# EAGLE design version_1_OK_fixed (EAGLE 6.5.0)
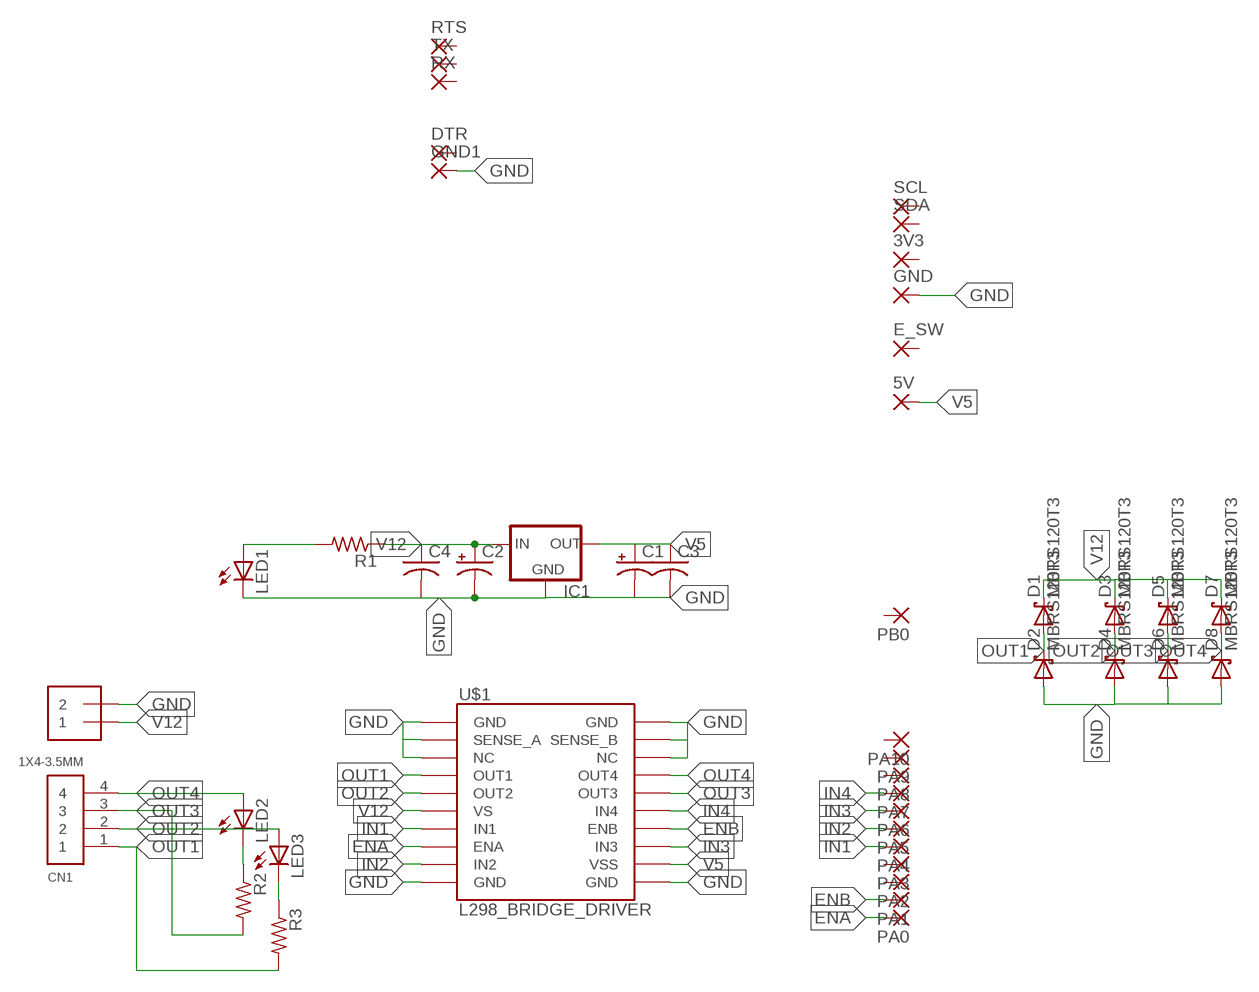
[diagram p0: schematic, sheet 1]

## Parts
3V3  1,6/0,9  [1,6/0,9]
5V  1,6/0,9  [1,6/0,9]
C1  CPOL-USA/3216-18R  [A/3216-18R]
C2  CPOL-USCT7343  [CT7343]
C3  C-USC0805  [C0805]
C4  C-USC0805  [C0805]
CN1  1X4-3.5MM  [1X04-3.5MM]
D1  MBRS120T3  [DO214AA]
D2  MBRS120T3  [DO214AA]
D3  MBRS120T3  [DO214AA]
D4  MBRS120T3  [DO214AA]
D5  MBRS120T3  [DO214AA]
D6  MBRS120T3  [DO214AA]
D7  MBRS120T3  [DO214AA]
D8  MBRS120T3  [DO214AA]
DTR  1,6/0,9  [1,6/0,9]
E_SW  1,6/0,9  [1,6/0,9]
GND  1,6/0,8  [1,6/0,8]
GND1  1,6/0,9  [1,6/0,9]
IC1  LM1117  [SOT223]
J1  1X2-3.5MM  [1X2-3.5MM]
LED1  LEDSMT1206  [1206]
LED2  LEDSMT1206  [1206]
LED3  LEDSMT1206  [1206]
PA0  1,6/0,9  [1,6/0,9]
PA1  1,6/0,9  [1,6/0,9]
PA2  1,6/0,9  [1,6/0,9]
PA3  1,6/0,9  [1,6/0,9]
PA4  1,6/0,9  [1,6/0,9]
PA5  1,6/0,9  [1,6/0,9]
PA6  1,6/0,9  [1,6/0,9]
PA7  1,6/0,9  [1,6/0,9]
PA8  1,6/0,9  [1,6/0,9]
PA9  1,6/0,9  [1,6/0,9]
PA10  1,6/0,9  [1,6/0,9]
PB0  1,6/0,9  [1,6/0,9]
R1  R-US_R0805  [R0805]
R2  R-US_R0805  [R0805]
R3  R-US_R0805  [R0805]
RTS  1,6/0,9  [1,6/0,9]
RX  1,6/0,9  [1,6/0,9]
SCL  1,6/0,9  [1,6/0,9]
SDA  1,6/0,9  [1,6/0,9]
TX  1,6/0,9  [1,6/0,9]
U$1  L298_BRIDGE_DRIVER  [POWERSO20]

## Nets
ENA: PA0.1(P) U$1.P$8(ENA)
ENB: PA1.1(P) U$1.P$14(ENB)
GND: C1.- C2.- C3.2 C4.2 D2.A D4.A D6.A D8.A GND1.1(P) GND.1(P) IC1.1(GND) J1.2 LED1.C U$1.P$1(GND) U$1.P$2(SENSE_A) U$1.P$3(NC) U$1.P$10(GND) U$1.P$11(GND) U$1.P$18(NC) U$1.P$19(SENSE_B) U$1.P$20(GND)
IN1: PA4.1(P) U$1.P$7(IN1)
IN2: PA5.1(P) U$1.P$9(IN2)
IN3: PA6.1(P) U$1.P$13(IN3)
IN4: PA7.1(P) U$1.P$15(IN4)
N$1: LED1.A R1.2
N$2: LED2.C R2.1
N$3: LED3.C R3.1
OUT1: CN1.1 D1.A D2.C R3.2 U$1.P$4(OUT1)
OUT2: CN1.2 D3.A D4.C LED3.A U$1.P$5(OUT2)
OUT3: CN1.3 D5.A D6.C R2.2 U$1.P$16(OUT3)
OUT4: CN1.4 D7.A D8.C LED2.A U$1.P$17(OUT4)
V5: 5V.1(P) C1.+ C3.1 IC1.2(OUT) U$1.P$12(VSS)
V12: C2.+ C4.1 D1.C D3.C D5.C D7.C IC1.3(IN) J1.1 R1.1 U$1.P$6(VS)
Unconnected: 3V3.1(P) DTR.1(P) E_SW.1(P) PA2.1(P) PA3.1(P) PA8.1(P) PA9.1(P) PA10.1(P) PB0.1(P) RTS.1(P) RX.1(P) SCL.1(P) SDA.1(P) TX.1(P)

## Library data of the parts
3V3 5V DTR E_SW GND1 PA0 PA1-PA10 PB0 RTS RX SCL SDA TX = wirepad:1,6/0,9: THROUGH-HOLE PAD
C1 C2 = adafruit:CPOL-US: POLARIZED CAPACITOR, American symbol
C3 C4 = adafruit:C-US: CAPACITOR, American symbol
CN1 = adafruit:1X4: 4-pin connector
D1-D8 = mbrs120t3:MBRS120T3: MBRS120T3 Surface Mount Schottky Power Rectifier Reichelt: MBRS 120 SMD
GND = wirepad:1,6/0,8: THROUGH-HOLE PAD
IC1 = v-reg-2:LM1117
J1 = adafruit:1X2: 3.5mm Terminal block http://www.ladyada.net/library/pcb/eaglelibrary.html
LED1-LED3 = adafruit:LED: LED OSRAM: - CHIPLED LG R971, LG N971, LY N971, LG Q971, LY Q971, LO R971, LY R971 LH N974, LH R974 LS Q976, LO Q976, LY Q976 LO Q996 - Hyper CHIPLED LW Q18S LB Q993, LB Q99A, LB R99A - SideLED LS A670, LO A670, LY A670, LG A670, LP A670 LB A673, LV A673, LT A673, LW A673 LH A674 LY A675 LS A676, LA A676, LO A676, LY A676, LW A676 LS A679, LY A679, LG A679 - Hyper Micro SIDELED® LS Y876, LA Y876, LO Y876, LY Y876 LT Y87S - SmartLED LW L88C, LW L88S LB L89C, LB L89S, LG L890 LS L89K, LO L89K, LY L89K LS L896, LA L896, LO L896, LY L896 - TOPLED LS T670, LO T670, LY T670, LG T670, LP T670 LSG T670, LSP T670, LSY T670, LOP T670, LYG T670 LG T671, LOG T671, LSG T671 LB T673, LV T673, LT T673, LW T673 LH T674 LS T676, LA T676, LO T676, LY T676, LB T676, LH T676, LSB T676, LW T676 LB T67C, LV T67C, LT T67C, LS T67K, LO T67K, LY T67K, LW E67C LS E67B, LA E67B, LO E67B, LY E67B, LB E67C, LV E67C, LT E67C LW T67C LS T679, LY T679, LG T679 LS T770, LO T770, LY T770, LG T770, LP T770 LB T773, LV T773, LT T773, LW T773 LH T774 LS E675, LA E675, LY E675, LS T675 LS T776, LA T776, LO T776, LY T776, LB T776 LHGB T686 LT T68C, LB T68C - Hyper Mini TOPLED® LB M676 - Mini TOPLED Santana® LG M470 LS M47K, LO M47K, LY M47K Source: http://www.osram.convergy.de/
R1-R3 = adafruit:R-US_: RESISTOR, American symbol
U$1 = SparkFun:L298_BRIDGE_DRIVER

## Board
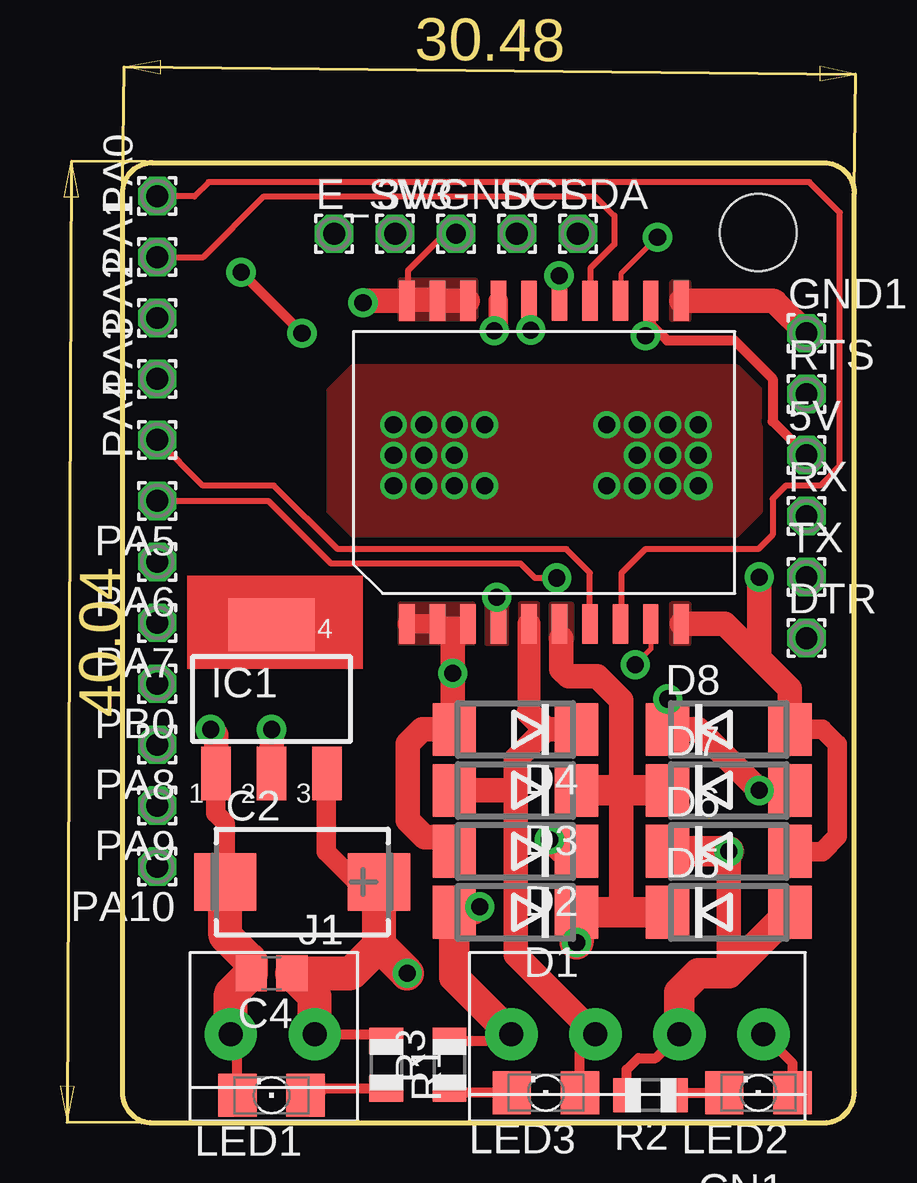
[diagram p1: board, top side]
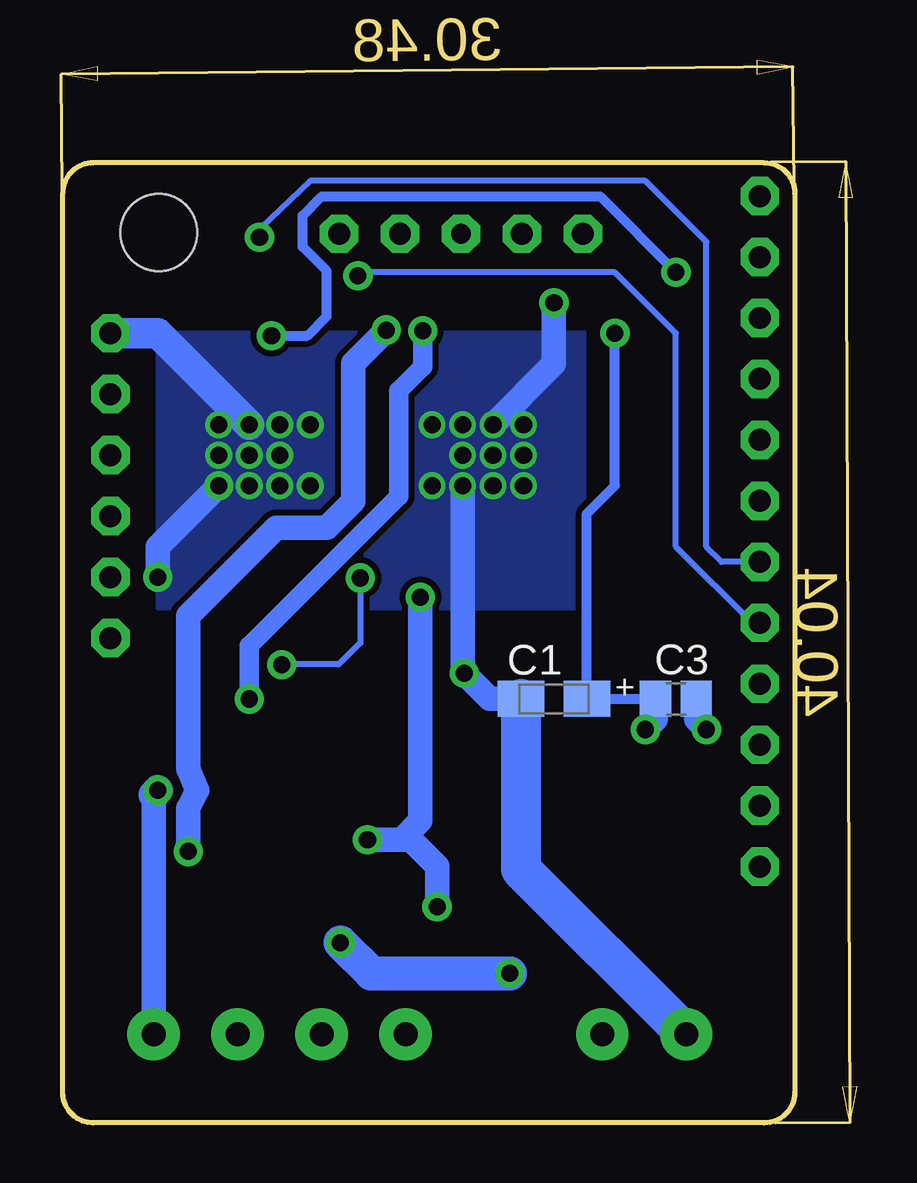
[diagram p2: board, bottom side, seen from below]

Size 33.15 x 44.28 mm. Coordinates in mm from the lower left corner, seen from the top.
Copper layers (1*16): Top 0.035mm / dielectric 1.5mm / Bottom 0.035mm
Design rules "default *": minimum track width 10mil, minimum drill 0.7mm, track to track 10mil, track to pad 10mil, pad to pad 10mil, via to via 10mil, smd to smd 10mil, copper to edge 40mil, drill to drill 8mil, minimum pad ring 10mil, minimum via ring 8mil, stop-mask expansion 4mil, vias tented up to drill 0mil, thermal gap 10mil
Holes 3.2 mm at 29.09,37.1
Milling: 8 lines

### Footprints (pad centres in the part's own frame; a part is rotated, then mirrored left to right if it is on the bottom)
1,6/0,9 = drill 0.914 pad 1.6 octagon: 1 0,0
A/3216-18R = smd 1.95 x 1.5: + 1.375,0; - -1.375,0
CT7343 = smd 2.6 x 2.4: + 3.2,0; - -3.2,0
C0805 = smd 1.3 x 1.5: 1 -0.85,0; 2 0.85,0
1X04-3.5MM = drill 1 pad 2.184: 1 -5.25,0; 2 -1.75,0; 3 1.75,0; 4 5.25,0
DO214AA = smd 1.8 x 2.2: A 2.55,0; C -2.55,0
1,6/0,8 = drill 0.813 pad 1.6 octagon: 1 0,0
SOT223 = smd 1.219 x 2.235: 1 -2.311,-3.099; 2 0,-3.099; 3 2.311,-3.099 | smd 3.6 x 2.2: 4 0,3.099
1X2-3.5MM = drill 1 pad 2.184: 1 1.8,0; 2 -1.7,0
1206 = smd 1.6 x 1.803: A -1.422,0; C 1.422,0
R0805 = smd 1.1 x 1.4: 1 -1,0; 2 1,0
POWERSO20 = smd 1.651 x 0.635: P$1 -6.731,5.715; P$2 -6.731,4.445; P$3 -6.731,3.175; P$4 -6.731,1.905; P$5 -6.731,0.635; P$6 -6.731,-0.635; P$7 -6.731,-1.905; P$8 -6.731,-3.175; P$9 -6.731,-4.445; P$10 -6.731,-5.715; P$11 6.731,-5.715; P$12 6.731,-4.445; P$13 6.731,-3.175; P$14 6.731,-1.905; P$15 6.731,-0.635; P$16 6.731,0.635; P$17 6.731,1.905; P$18 6.731,3.175; P$19 6.731,4.445; P$20 6.731,5.715

### Placement (x,y rotation side)
3V3  13.96,37.05 0 top
5V  31.1,27.82 0 top
C1  12.62,17.66 0 bottom
C2  10.08,10.04 0 top
C3  7.54,17.66 0 bottom
C4  8.81,6.23 180 top
CN1  24.05,3.69 0 top
D1  18.97,8.77 180 top
D2  18.97,11.31 180 top
D3  18.97,13.85 180 top
D4  18.97,16.39 180 top
D5  27.86,8.77 0 top
D6  27.86,11.31 0 top
D7  27.86,13.85 0 top
D8  27.86,16.39 0 top
DTR  31.1,20.2 0 top
E_SW  11.42,37.05 0 top
GND  16.5,37.05 0 top
GND1  31.1,32.9 0 top
IC1  8.81,17.66 0 top
J1  8.81,3.69 0 top
LED1  8.81,1.15 180 top
LED2  29.1,1.25 180 top
LED3  20.24,1.25 180 top
PA0  4.05,38.61 90 top
PA1  4.05,36.08 90 top
PA2  4.05,33.53 90 top
PA3  4.05,31 90 top
PA4  4.05,28.45 90 top
PA5  4.05,25.91 180 top
PA6  4.05,23.38 180 top
PA7  4.05,20.84 180 top
PA8  4.05,15.76 180 top
PA9  4.05,13.21 180 top
PA10  4.05,10.68 180 top
PB0  4.05,18.3 180 top
R1  13.59,2.42 270 top
R2  24.61,1.15 180 top
R3  16.23,2.42 90 top
RTS  31.1,30.36 0 top
RX  31.1,25.28 0 top
SCL  19.04,37.05 0 top
SDA  21.58,37.05 0 top
TX  31.1,22.74 0 top
U$1  20.17,27.52 90 top

### Tracks (layer width: path | path; a pad name or v marks a point on that pad's centre or on a via)
ENA
  Top 0.203: 23.39,20.83 U$1.P$8
  Top 0.254: 23.39,20.83 23.39,22.9 24.39,23.9 29.09,23.9 29.69,24.5 29.69,26 30.24,26.55 31.67,26.55 32.49,27.37 32.49,37.93 31.22,39.2 6.19,39.2 5.59,38.6 PA0.1
ENB
  Top 0.203: 22.09,34.27 U$1.P$14
  Top 0.254: PA1.1 5.97,36.08 8.49,38.6 22.29,38.6 23.09,37.8 23.09,36.6 22.09,35.6 22.09,34.27
GND  (via drill 0.71, 0.71 pad 1.22)
  Top 0.203: 14.49,34.29 U$1.P$20
  Top 0.254: GND.1 16.04,37.05 14.49,35.5 14.49,34.29
  Top 0.406: LED1.C 7.39,3.31
  Top 0.61: 15.69,34.29 U$1.P$19 | U$1.P$2 16.43,20.79 | 16.43,20.79 U$1.P$3 | 16.43,20.2 16.43,20.79
  Top 0.813: U$1.P$1 U$1.P$2 | C2.- 6.88,12.41 arc45 6.81,12.58 6.49,12.9 6.49,14.54 arc-45 IC1.1 | D6.A 31.76,11.3 32.39,11.93 32.39,15.77 31.76,16.4 30.44,16.4 arc45 D8.A | 30.41,18.08 30.34,18.15 | U$1.P$10
  Top 1.016: 14.49,34.29 15.69,34.29 | U$1.P$19 U$1.P$18 | U$1.P$11 29.65,34.25 arc-45 29.83,34.18 GND1.1 | U$1.P$20 12.81,34.25 arc45 v12.63,34.18 v12.62,34.17 | 7.39,3.31 arc45 7.32,3.49 J1.2 | D8.A 30.41,18.08 | 29.13,19.36 27.69,20.8 U$1.P$10 | D2.A 15.83,11.9 15.19,11.9 14.49,12.6 14.49,15.8 15.08,16.39 D4.A 16.36,16.45 v16.36,18.73 16.36,20.13 16.43,20.2 | v29.13,22.74 29.13,19.36 | 29.13,19.36 30.34,18.15 | IC1.1 6.5,16.16 v6.27,16.39
  Top 1.422: J1.2 7.11,5.28 arc-45 7.19,5.45 C4.2 7.96,6.62 arc45 7.89,6.8 6.89,7.8 6.89,10.02 arc45 C2.-
  Bottom 1.016: v15.16,29.09 12.62,31.63 v12.62,34.17 | C1.- 15.29,17.66 v16.36,18.73 16.43,18.8 v16.43,26.55 | v29.13,22.74 29.13,24.01 v26.59,26.55 | C3.2 6.69,16.81 v6.27,16.39
  Bottom 1.27: v25.32,29.09 29.13,32.9 GND1.1
  Bottom 1.676: C1.- 14,10.57 J1.2
  other vias: 13.89,26.55 15.16,26.55 13.89,27.82 13.89,29.09 15.16,27.82 16.43,29.09 16.43,27.82 17.7,29.09 22.78,29.09 22.78,26.55 17.7,26.55 24.05,27.82 24.05,26.55 24.05,29.09 25.32,26.55 25.32,27.82 26.59,29.09 26.59,27.82
  pour Top: 28.19,24.5 29.19,25.5 29.19,30.5 28.19,31.5 12.19,31.5 11.19,30.5 11.19,25.5 12.19,24.5
  pour Bottom (isolate 0.254): 11.35,32.9 29.13,32.9 29.13,21.47 11.35,21.47
  pour Top (isolate 0.254, no thermals): 14.19,21.6 17.19,21.6 17.19,21.5 17.19,20 14.19,20
  pour Top (isolate 0.254, no thermals): 14.19,35.1 17.29,35.1 17.29,33.5 14.19,33.5
  pour Top (isolate 0.254, no thermals): 25.59,35 25.49,35 25.49,33.5 26.19,33.5 26.19,35
  pour Top (isolate 0.254, no thermals): 25.49,21.6 25.49,20 26.19,20 26.19,21.6
IN1
  Top 0.254: U$1.P$7 22.08,22.91 21.09,23.9 11.56,23.9 8.91,26.55 5.96,26.55 PA4.1
IN2  (via drill 0.71 pad 1.22)
  Top 0.203: U$1.P$9 24.62,19.74 v23.96,19.09 | 4.07,25.9 PA5.1
  Top 0.254: v20.69,22.7 19.79,22.7 19.19,23.3 11.29,23.3 8.69,25.9 4.07,25.9
  Bottom 0.203: 24.05,19.1 v23.96,19.09
  Bottom 0.254: v20.69,22.7 20.69,20 21.59,19.1 24.05,19.1
IN3  (via drill 0.71 pad 1.22)
  Top 0.203: 23.39,34.3 23.39,35.4 v24.89,36.9
  Top 0.406: 23.39,34.3 U$1.P$13
  Bottom 0.254: PA6.1 5.64,23.38 6.27,24.01 6.27,36.71 8.81,39.25 22.78,39.25 24.85,37.28 24.85,36.86 v24.89,36.9
IN4  (via drill 0.71 pad 1.22)
  Top 0.406: U$1.P$15 20.81,35.28 v20.79,35.3
  Bottom 0.203: PA7.1 4.37,20.84 | 20.65,35.44 v20.79,35.3
  Bottom 0.254: 4.37,20.84 7.54,24.01 7.54,32.9 10.08,35.44 20.65,35.44
N$1
  Top 0.406: R1.2 10.61,1.42
  Top 1.016: 10.61,1.42 arc45 10.43,1.35 LED1.A
N$2
  Top 0.254: R2.1 25.59,1.1 25.59,1.25
  Top 0.406: 25.59,1.25 LED2.C
N$3
  Top 0.203: 16.71,1.25 arc-45 16.63,1.22 R3.1
  Top 0.406: LED3.C 16.71,1.25
OUT1  (via drill 0.71 pad 1.22)
  Top 0.203: 18.43,3.42 arc45 18.61,3.49 CN1.1
  Top 0.406: R3.2 18.43,3.42
  Top 1.016: D1.A 17.26,8.77 v17.49,9 | D2.C 20.88,11.31 v20.39,11.8 | 18.27,21.88 v18.19,21.9
  Top 1.27: D1.A 16.42,6.07 CN1.1
  Bottom 1.016: v17.49,9 17.49,10.7 18.59,11.8 18.97,11.8 | 18.97,11.8 v20.39,11.8 | 18.97,11.8 18.19,12.58 v18.19,21.9
  pour Top (isolate 0.254, no thermals): 17.79,21.9 17.79,20 18.59,20 18.59,21.9
OUT2
  Top 0.203: 21.67,2.95 arc-45 21.74,3.13 CN1.2
  Top 0.406: LED3.A 21.67,2.95
  Top 0.965: U$1.P$5 19.54,17.09
  Top 1.016: CN1.2 18.99,7 18.99,13.85 | 18.99,13.85 18.99,15.14 20.24,16.39 | 20.24,16.39 D4.C | D3.A 18.99,13.85 | 19.54,17.09 20.24,16.39
  pour Top (isolate 0.254, no thermals): 19.89,20 19.89,21.6 19.19,21.6 19.19,20
OUT3  (via drill 0.71 pad 1.22)
  Top 0.406: R2.2 23.61,2.22 24.09,2.7 24.81,2.7 CN1.3
  Top 0.61: U$1.P$16 19.54,33.11 v19.61,33.03
  Top 1.016: v27.86,11.31 27.86,6.24
  Top 1.27: CN1.3 25.8,5.44 26.59,6.23 27.87,6.23 | 27.87,6.23 D5.A | D6.C v27.86,11.31 | 27.86,6.24 27.87,6.23
  Bottom 0.406: 27.79,13.1 27.86,13.1
  Bottom 1.016: v19.61,33.03 20.99,31.65 20.99,25.9 22.09,24.8 24.19,24.8 27.86,21.13 27.86,14.75 27.49,13.85 27.86,13.1 v27.86,11.31
OUT4  (via drill 0.71 pad 1.22)
  Top 0.406: LED2.A 30.52,2.47 CN1.4
  Top 0.813: D8.C v25.31,17.65 v25.32,17.66 | U$1.P$17 18.27,33.17 v18.09,33
  Top 1.016: D7.A v29.13,13.85 26.59,16.39 D8.C
  Bottom 0.813: v25.32,17.66 25.32,19.87 19.09,26.1 19.09,30.5 18.09,31.5 v18.09,33
  Bottom 1.016: CN1.4 29.3,13.68
  Bottom 1.27: 29.3,13.68 v29.13,13.85
V5  (via drill 0.71 pad 1.22)
  Top 0.406: U$1.P$12 24.62,33.27 | 24.62,33.27 25.29,32.6 28.09,32.6 29.69,31 29.69,29.23 5V.1 | v24.39,32.8 24.39,33.05 24.62,33.27 | v10.08,32.9 v7.54,35.44
  Top 1.016: IC1.2 v8.81,16.39
  Bottom 0.406: C3.1 C1.+ 11.25,25.39 10.08,26.55 v10.08,32.9 | v24.39,32.8 22.89,32.8 22.09,33.6 22.09,35.5 23.09,36.5 23.09,37.8 22.29,38.6 10.7,38.6 v7.54,35.44
  Bottom 1.016: C3.1 8.39,16.81 v8.81,16.39
V12  (via drill 0.71 pad 1.22)
  Top 0.406: J1.1 13.52,3.69 arc-45 13.7,3.62 R1.1 | 20.89,20.2 20.89,20.7 U$1.P$6
  Top 0.813: C2.+ 12.46,10.04 arc-45 12.28,10.11 11.09,11.3 11.09,14.48 arc-45 IC1.3
  Top 1.016: 23.39,8.77 23.39,13.85 23.39,17.6 22.39,18.6 21.19,18.6 20.89,18.9 20.89,20.2
  Top 1.27: D1.C D5.C 23.39,8.77 | D7.C 23.39,13.85 D3.C
  Top 1.422: J1.1 10.61,5.17 arc45 10.54,5.35 C4.1 12.02,6.23 arc45 12.2,6.3 13.29,7.4 | 13.29,7.4 13.29,10.02 arc45 C2.+ | D1.C v21.52,7.51 | v14.46,6.23 13.29,7.4
  Bottom 1.422: v21.52,7.51 20.24,6.23 v14.46,6.23
  pour Top (isolate 0.254, no thermals): 20.49,20.1 20.49,21.6 21.19,21.6 21.29,21.6 21.29,20.1
(copper drawn outside any net)
  shapes: Top area x1